# EAGLE design 20190105_ORIGAMI_V1-1-V (EAGLE 9.2.0)
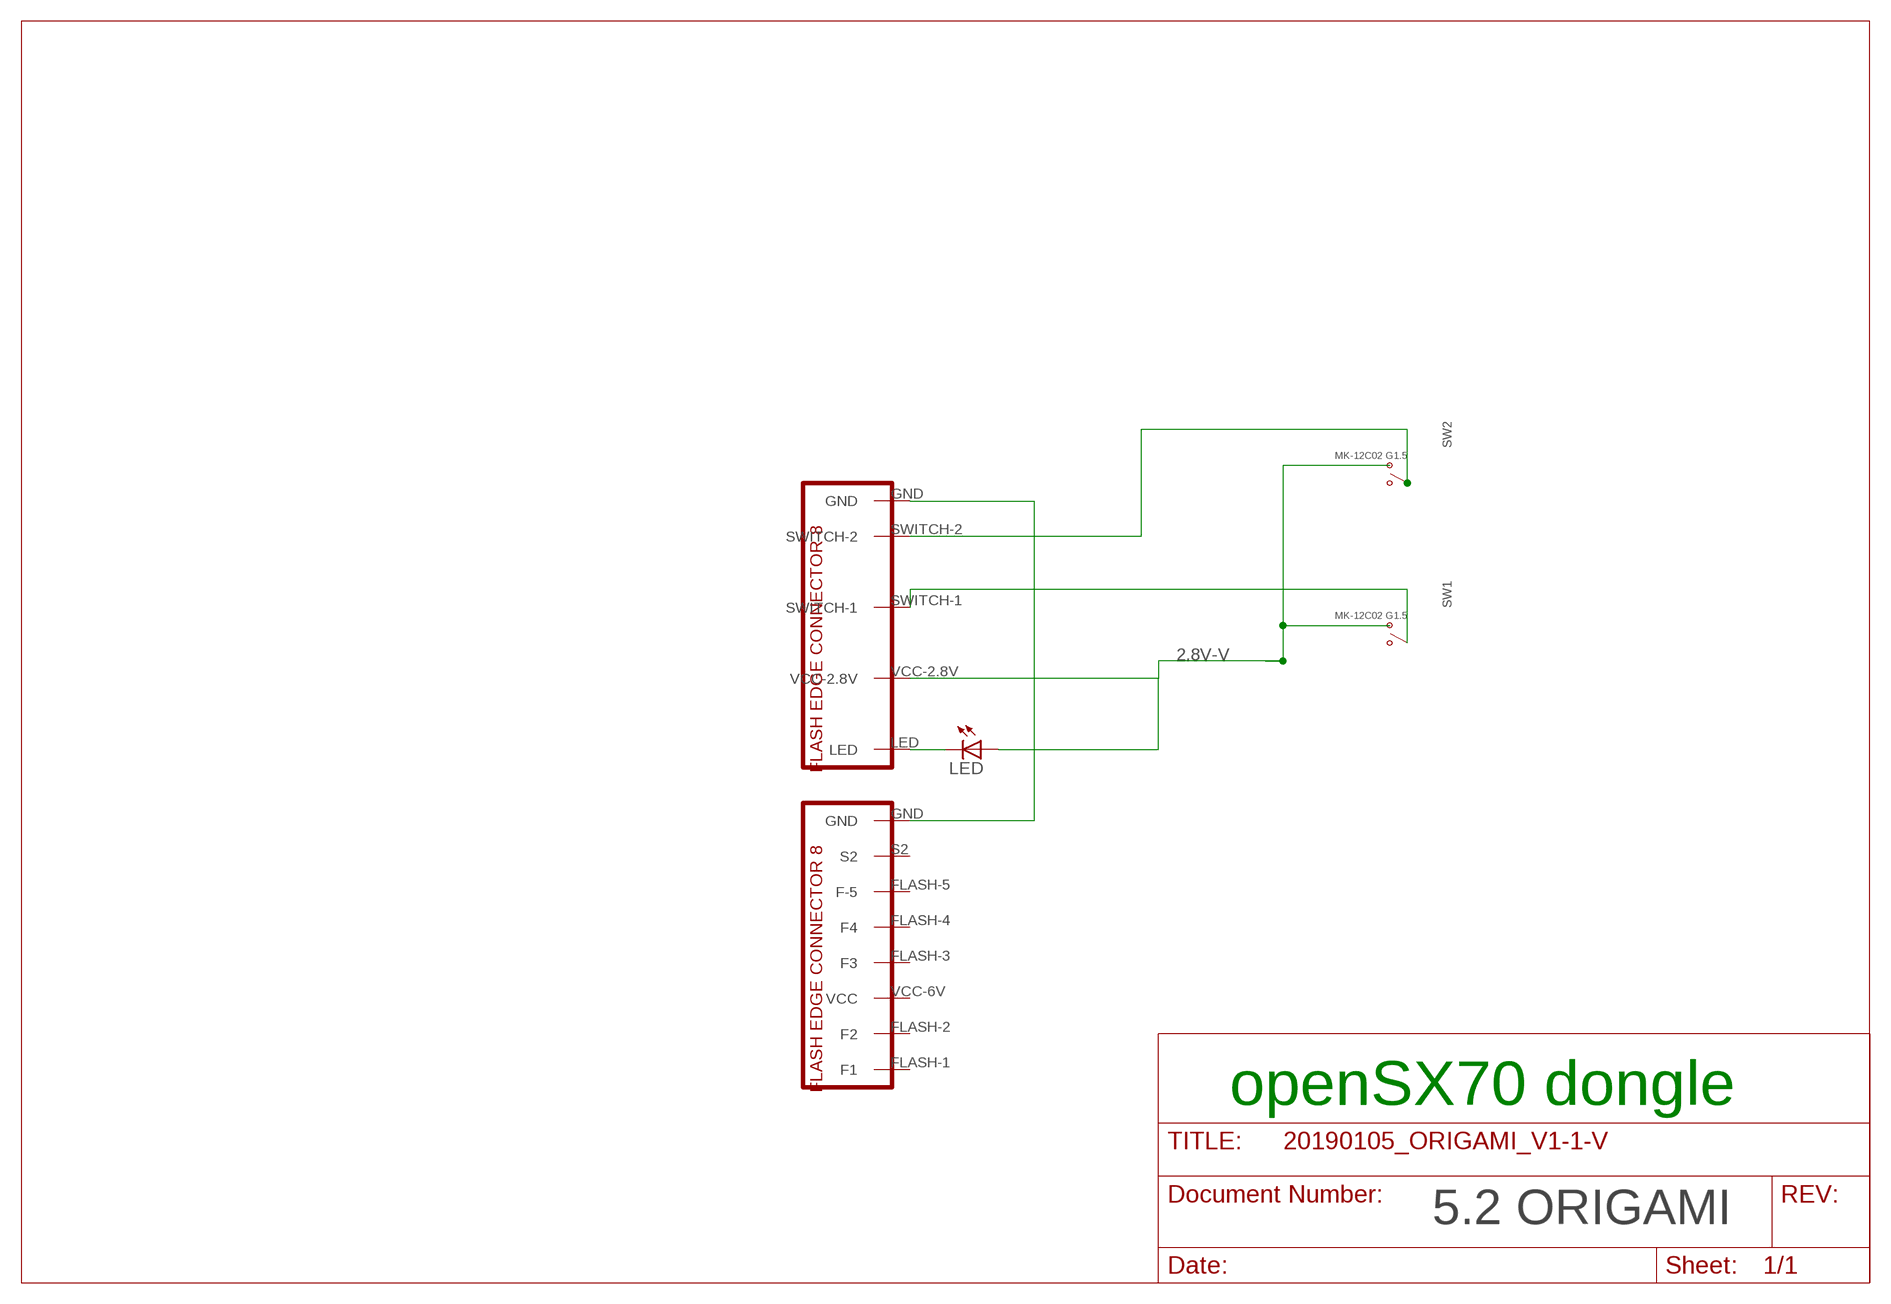
[diagram p0: schematic, sheet 1]

## Parts
LED  LEDCHIP-LED0805  [CHIP-LED0805]
SW1  MK-12C02 G1.5  SSSS810701  [SSSS810701]
SW2  MK-12C02 G1.5  SSSS810701  [SSSS810701]
U$1  FLASH-BRIDGE-SW1-SW2-LED-SMALL  [FLASH-8-BRIDGE-SW1-SW2-LED-SMALL]
U$2  SX70-FLASH-EDGE8-MALE-LONG  [SX70-FLASH-EDGE8-2]

## Nets
2.8V-V: LED.A SW1.1(B) SW2.1(B) U$1.VCC-2.8V
N$1: U$1.GND U$2.GND
N$2: SW2.2(COM) U$1.SWITCH-2
N$4: LED.C U$1.LED
N$5: SW1.2(COM) U$1.SWITCH-1
Unconnected: SW1.3(A) SW2.3(A) U$2.FLASH-1(F1) U$2.FLASH-2(F2) U$2.FLASH-3(F3) U$2.FLASH-4(F4) U$2.FLASH-5(F-5) U$2.S2 U$2.VCC-6V(VCC)

## Notes on the sheet
- openSX70 dongle
- 5.2 ORIGAMI

## Library data of the parts
LED = led:LED: LED OSRAM: - CHIPLED LG R971, LG N971, LY N971, LG Q971, LY Q971, LO R971, LY R971 LH N974, LH R974 LS Q976, LO Q976, LY Q976 LO Q996 - Hyper CHIPLED LW Q18S LB Q993, LB Q99A, LB R99A - SideLED LS A670, LO A670, LY A670, LG A670, LP A670 LB A673, LV A673, LT A673, LW A673 LH A674 LY A675 LS A676, LA A676, LO A676, LY A676, LW A676 LS A679, LY A679, LG A679 - Hyper Micro SIDELED® LS Y876, LA Y876, LO Y876, LY Y876 LT Y87S - SmartLED LW L88C, LW L88S LB L89C, LB L89S, LG L890 LS L89K, LO L89K, LY L89K LS L896, LA L896, LO L896, LY L896 - TOPLED LS T670, LO T670, LY T670, LG T670, LP T670 LSG T670, LSP T670, LSY T670, LOP T670, LYG T670 LG T671, LOG T671, LSG T671 LB T673, LV T673, LT T673, LW T673 LH T674 LS T676, LA T676, LO T676, LY T676, LB T676, LH T676, LSB T676, LW T676 LB T67C, LV T67C, LT T67C, LS T67K, LO T67K, LY T67K, LW E67C LS E67B, LA E67B, LO E67B, LY E67B, LB E67C, LV E67C, LT E67C LW T67C LS T679, LY T679, LG T679 LS T770, LO T770, LY T770, LG T770, LP T770 LB T773, LV T773, LT T773, LW T773 LH T774 LS E675, LA E675, LY E675, LS T675 LS T776, LA T776, LO T776, LY T776, LB T776 LHGB T686 LT T68C, LB T68C - Hyper Mini TOPLED® LB M676 - Mini TOPLED Santana® LG M470 LS M47K, LO M47K, LY M47K Source: http://www.osram.convergy.de LUXEON: - LUMILED® LXK2-PW12-R00, LXK2-PW12-S00, LXK2-PW14-U00, LXK2-PW14-V00 LXK2-PM12-R00, LXK2-PM12-S00, LXK2-PM14-U00 LXK2-PE12-Q00, LXK2-PE12-R00, LXK2-PE12-S00, LXK2-PE14-T00, LXK2-PE14-U00 LXK2-PB12-K00, LXK2-PB12-L00, LXK2-PB12-M00, LXK2-PB14-N00, LXK2-PB14-P00, LXK2-PB14-Q00 LXK2-PR12-L00, LXK2-PR12-M00, LXK2-PR14-Q00, LXK2-PR14-R00 LXK2-PD12-Q00, LXK2-PD12-R00, LXK2-PD12-S00 LXK2-PH12-R00, LXK2-PH12-S00 LXK2-PL12-P00, LXK2-PL12-Q00, LXK2-PL12-R00 Source: www.luxeon.com KINGBRIGHT: KA-3528ASYC Source: www.kingbright.com
SW1 SW2 = _openSX70:SSSS810701; AVAILABILITY: Good; DESCRIPTION: Slide Switch • Rating (max.): 0.3 A 5 VDC • Poles: 1 • Positions: 2 • Travel : 1.5 mm • Operating direction: Horizontal; MF: ALPS; MP: SSSS810701; PACKAGE: None; PRICE: 0.53 USD
U$1 = _openSX70:FLASH-BRIDGE-SW1-SW2-LED-SMALL
U$2 = _openSX70:SX70-FLASH-EDGE8-MALE-LONG

## Net classes
0 GND: width 0.305 mm
1 VCC: width 0.254 mm
2 2.8V: width 0.254 mm

## Board
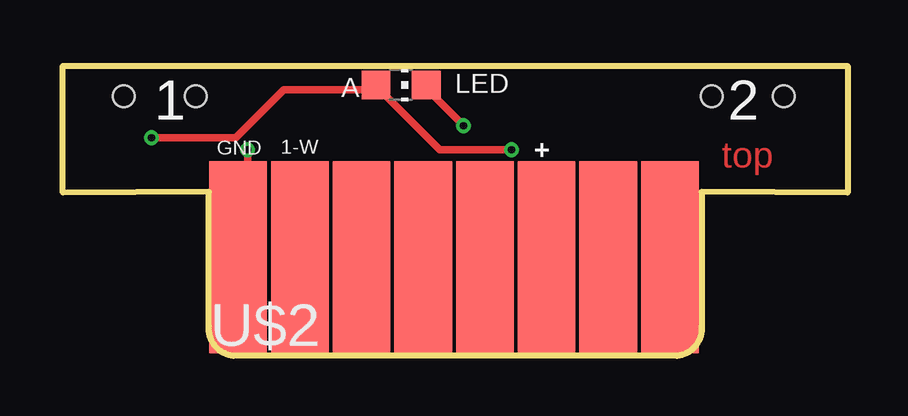
[diagram p1: board, top side]
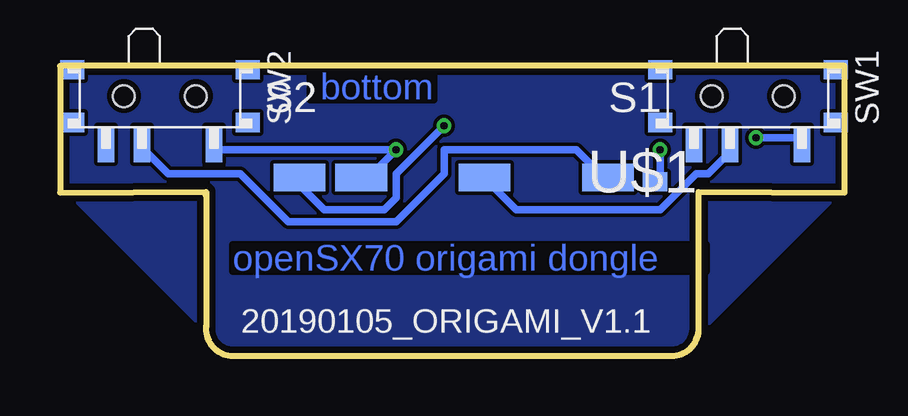
[diagram p2: board, bottom side, seen from below]

Size 32.69 x 12.09 mm. Coordinates in mm from the lower left corner, seen from the top.
Outline: 26.61,6.83 26.61,1.24 arc-90 25.59,0 7.1,0 arc-90 6.08,1.24 6.08,6.83 0,6.81 0,12.09 32.69,12.09 32.69,6.81 26.61,6.83
Outline: 26.61,6.83 26.63,6.71
Copper layers (1*16): Top 0.035mm / dielectric 1.5mm / Bottom 0.035mm
Design rules "SeeedStudio_2layer_DRU_no_angle_20140221": minimum track width 6mil, minimum drill 12mil, track to track 6mil, track to pad 6mil, pad to pad 6mil, via to via 6mil, smd to smd 0mil, copper to edge 10mil, drill to drill 10mil, minimum pad ring 10mil, minimum via ring 6mil, stop-mask expansion 2mil, vias tented up to drill 100mil, thermal gap 10mil

### Footprints (pad centres in the part's own frame; a part is rotated, then mirrored left to right if it is on the bottom)
CHIP-LED0805 = smd 1.2 x 1.2: A 0,-1.05; C 0,1.05
SSSS810701 = smd 0.7 x 1.5: 1 -2.25,2; 2 0.75,2; 3 2.25,2 | smd 1 x 0.8: 4.1 -3.65,1.1; 4.2 3.65,1.1; 4.3 -3.65,-1.1; 4.4 3.65,-1.1 | hole 0.9: 1.5,0; -1.5,0
FLASH-8-BRIDGE-SW1-SW2-LED-SMALL = smd 1.016 x 0.8: GND -8.39,5.138 | smd 2.159 x 1.143: LED 6.42,4.96; SWITCH-1 -1.29,4.96; SWITCH-2 -6.43,4.96; VCC-2.8V 3.85,4.96
SX70-FLASH-EDGE8-2 = smd 2.4 x 8: FLASH-1 8.99,7.5; FLASH-2 6.42,7.5; FLASH-3 1.28,7.5; FLASH-4 -1.29,7.5; FLASH-5 -3.86,7.5; GND -9,7.5; S2 -6.43,7.5; VCC-6V 3.85,7.5

### Placement (x,y rotation side)
LED  14.09,11.29 270 top
SW1  4.03,10.83 180 bottom
SW2  28.53,10.83 180 bottom
U$1  16.29,12.39 180 bottom
U$2  16.3,-3.4 0 top

### Tracks (layer width: path | path; a pad name or v marks a point on that pad's centre or on a via)
2.8V-V  (via drill 0.3)
  Top 0.305: v18.69,8.59 15.69,8.59 13.19,11.09 LED.A 12.69,11.09 9.19,11.09 7.19,9.09 v3.69,9.09
  Bottom 0.305: U$1.VCC-2.8V 19.69,7.59 v18.69,8.59 26.19,8.59 SW2.1 | v3.69,9.09 1.69,9.09 SW1.1
GND
  pour Bottom: -0.01,12.19 -0.01,6.99 6.99,-0.01 25.19,-0.01 25.39,-0.21 32.39,6.79 32.79,6.79 32.79,12.19 32.69,12.29 0.09,12.29
N$1  (via drill 0.3)
  Top 0.305: v7.69,8.59 7.69,4.59 U$2.GND
  Bottom 0.305: v7.69,8.59 7.69,7.59 U$1.GND
N$2
  Bottom 0.305: SW2.2 29.19,8.59 28.19,7.59 25.19,7.59 23.19,5.59 18.69,5.59 16.69,7.59 16.69,8.59 11.19,8.59 10.19,7.59 U$1.SWITCH-2
N$4  (via drill 0.3)
  Top 0.305: v16.69,9.59 15.19,11.09 LED.C
  Bottom 0.305: v16.69,9.59 18.69,7.59 18.69,6.59 19.19,6.09 21.69,6.09 22.69,7.09 U$1.LED
N$5
  Bottom 0.305: SW1.2 4.69,8.59 5.69,7.59 6.19,7.59 7.69,6.09 13.69,6.09 14.69,7.09 U$1.SWITCH-1

### Text on the board
Top: top
Bottom: bottom | openSX70 origami dongle
tPlace: + | +
bPlace: 20190105_ORIGAMI_V1.1
tNames: A | 1 | 2 | GND | 1-W
bNames: S1 | S2